# Altium schematic sheet Sheet_1_2021-10-21.schdoc
size 67 x 71 mm
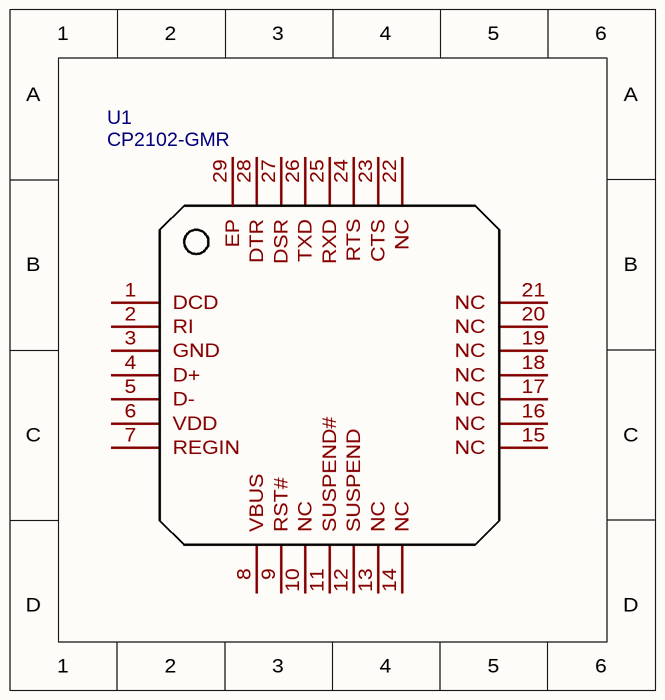
[diagram p0: Sheet_1_2021-10-21.schdoc]

## Parts
U1  CP2102-GMR  [QFN-28_L5.0-W5.0-P0.50-BL-EP]

## Nets

Not connected (* = marked no-connect by the designer): U1 1(DCD) 2(RI) 3(GND) 4(D+) 5(D-) 6(VDD) 7(REGIN) 8(VBUS) 9(RST#) 10(NC) 11(SUSPEND#) 12(SUSPEND) 13(NC) 14(NC) 15(NC) 16(NC) 17(NC) 18(NC) 19(NC) 20(NC) 21(NC) 22(NC) 23(CTS) 24(RTS) 25(RXD) 26(TXD) 27(DSR) 28(DTR) 29(EP)

## Library data of the parts
U1 = CP2102-GMR: BOM_Manufacturer: SILICON LABS; BOM_Supplier: LCSC; BOM_Manufacturer Part: CP2102-GMR; BOM_Supplier Part: C6568; BOM_JLCPCB Part Class: Basic Part; spicePre: U; spiceSymbolName: CP2102-GMR